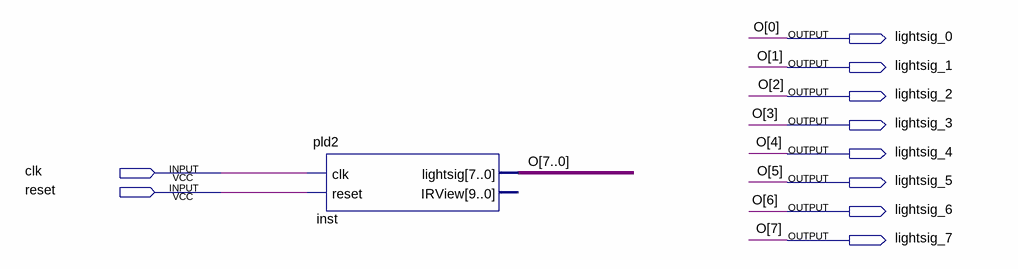
[diagram p0: schematic sheet]
// Quartus schematic pld2board.bdf as structural Verilog: 1 symbols, 10 pins
module pld2board (
  input  clk,
  input  reset,
  output lightsig_0,
  output lightsig_1,
  output lightsig_2,
  output lightsig_3,
  output lightsig_4,
  output lightsig_5,
  output lightsig_6,
  output lightsig_7
);

  pld2 inst (
    .clk(clk), .reset(reset),
    .lightsig({lightsig_7, lightsig_6, lightsig_5, lightsig_4, lightsig_3, lightsig_2, lightsig_1, lightsig_0}));  // open: IRView

  // Other names for the same wires on the sheet: O[7:0] = {lightsig_7, lightsig_6, lightsig_5, lightsig_4, lightsig_3, lightsig_2, lightsig_1, lightsig_0}
endmodule
